# Altium schematic sheet LED Module.SchDoc
size A4
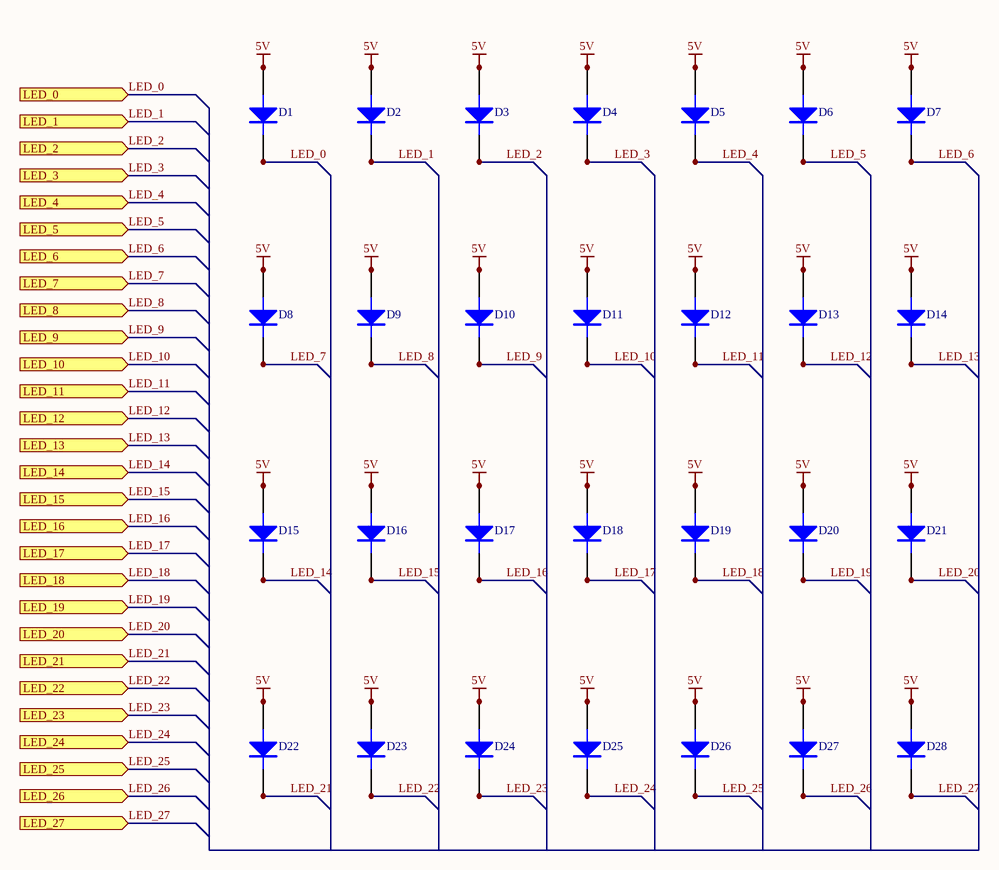
[diagram p0: LED Module.SchDoc]

## Parts
D1  AMBER  [CREE P4 YELLOW]  (value not drawn)
D2  AMBER  [CREE P4 YELLOW]  (value not drawn)
D3  AMBER  [CREE P4 YELLOW]  (value not drawn)
D4  AMBER  [CREE P4 YELLOW]  (value not drawn)
D5  AMBER  [CREE P4 YELLOW]  (value not drawn)
D6  AMBER  [CREE P4 YELLOW]  (value not drawn)
D7  AMBER  [CREE P4 YELLOW]  (value not drawn)
D8  AMBER  [CREE P4 YELLOW]  (value not drawn)
D9  AMBER  [CREE P4 YELLOW]  (value not drawn)
D10  AMBER  [CREE P4 YELLOW]  (value not drawn)
D11  AMBER  [CREE P4 YELLOW]  (value not drawn)
D12  AMBER  [CREE P4 YELLOW]  (value not drawn)
D13  AMBER  [CREE P4 YELLOW]  (value not drawn)
D14  AMBER  [CREE P4 YELLOW]  (value not drawn)
D15  AMBER  [CREE P4 YELLOW]  (value not drawn)
D16  AMBER  [CREE P4 YELLOW]  (value not drawn)
D17  AMBER  [CREE P4 YELLOW]  (value not drawn)
D18  AMBER  [CREE P4 YELLOW]  (value not drawn)
D19  AMBER  [CREE P4 YELLOW]  (value not drawn)
D20  AMBER  [CREE P4 YELLOW]  (value not drawn)
D21  AMBER  [CREE P4 YELLOW]  (value not drawn)
D22  AMBER  [CREE P4 YELLOW]  (value not drawn)
D23  AMBER  [CREE P4 YELLOW]  (value not drawn)
D24  AMBER  [CREE P4 YELLOW]  (value not drawn)
D25  AMBER  [CREE P4 YELLOW]  (value not drawn)
D26  AMBER  [CREE P4 YELLOW]  (value not drawn)
D27  AMBER  [CREE P4 YELLOW]  (value not drawn)
D28  AMBER  [CREE P4 YELLOW]  (value not drawn)

## Ports
LED_0 (in), LED_1 (in), LED_2 (in), LED_3 (in), LED_4 (in), LED_5 (in), LED_6 (in), LED_7 (in), LED_8 (in), LED_9 (in), LED_10 (in), LED_11 (in), LED_12 (in), LED_13 (in), LED_14 (in), LED_15 (in), LED_16 (in), LED_17 (in), LED_18 (in), LED_19 (in), LED_20 (in), LED_21 (in), LED_22 (in), LED_23 (in), LED_24 (in), LED_25 (in), LED_26 (in), LED_27 (in)

## Nets
5V: D1.2(A) D1.3(A) D2.2(A) D2.3(A) D3.2(A) D3.3(A) D4.2(A) D4.3(A) D5.2(A) D5.3(A) D6.2(A) D6.3(A) D7.2(A) D7.3(A) D8.2(A) D8.3(A) D9.2(A) D9.3(A) D10.2(A) D10.3(A) D11.2(A) D11.3(A) D12.2(A) D12.3(A) D13.2(A) D13.3(A) D14.2(A) D14.3(A) D15.2(A) D15.3(A) D16.2(A) D16.3(A) D17.2(A) D17.3(A) D18.2(A) D18.3(A) D19.2(A) D19.3(A) D20.2(A) D20.3(A) D21.2(A) D21.3(A) D22.2(A) D22.3(A) D23.2(A) D23.3(A) D24.2(A) D24.3(A) D25.2(A) D25.3(A) D26.2(A) D26.3(A) D27.2(A) D27.3(A) D28.2(A) D28.3(A)
LED_0: D1.1(K) D1.4(K) ; port LED_0
LED_1: D2.1(K) D2.4(K) ; port LED_1
LED_2: D3.1(K) D3.4(K) ; port LED_2
LED_3: D4.1(K) D4.4(K) ; port LED_3
LED_4: D5.1(K) D5.4(K) ; port LED_4
LED_5: D6.1(K) D6.4(K) ; port LED_5
LED_6: D7.1(K) D7.4(K) ; port LED_6
LED_7: D8.1(K) D8.4(K) ; port LED_7
LED_8: D9.1(K) D9.4(K) ; port LED_8
LED_9: D10.1(K) D10.4(K) ; port LED_9
LED_10: D11.1(K) D11.4(K) ; port LED_10
LED_11: D12.1(K) D12.4(K) ; port LED_11
LED_12: D13.1(K) D13.4(K) ; port LED_12
LED_13: D14.1(K) D14.4(K) ; port LED_13
LED_14: D15.1(K) D15.4(K) ; port LED_14
LED_15: D16.1(K) D16.4(K) ; port LED_15
LED_16: D17.1(K) D17.4(K) ; port LED_16
LED_17: D18.1(K) D18.4(K) ; port LED_17
LED_18: D19.1(K) D19.4(K) ; port LED_18
LED_19: D20.1(K) D20.4(K) ; port LED_19
LED_20: D21.1(K) D21.4(K) ; port LED_20
LED_21: D22.1(K) D22.4(K) ; port LED_21
LED_22: D23.1(K) D23.4(K) ; port LED_22
LED_23: D24.1(K) D24.4(K) ; port LED_23
LED_24: D25.1(K) D25.4(K) ; port LED_24
LED_25: D26.1(K) D26.4(K) ; port LED_25
LED_26: D27.1(K) D27.4(K) ; port LED_26
LED_27: D28.1(K) D28.4(K) ; port LED_27

## Library data of the parts
D1-D28 = CP41B-AFSCM0Q0264: CREE AMBER LED P4 (SUPERFLUX)